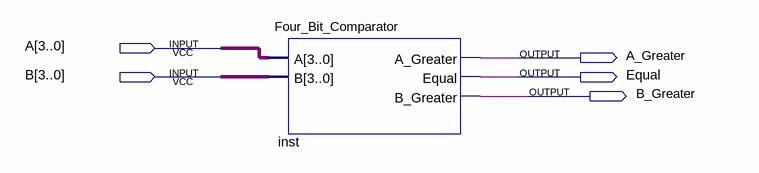
[diagram p0: schematic sheet]
// Quartus schematic Block4.bdf as structural Verilog: 1 symbols, 5 pins
module Block4 (
  input  [3:0] A,
  input  [3:0] B,
  output A_Greater,
  output Equal,
  output B_Greater
);

  Four_Bit_Comparator inst (.A(A), .B(B), .A_Greater(A_Greater), .Equal(Equal), .B_Greater(B_Greater));
endmodule
